# Altium schematic sheet PWR_PROT.SchDoc
size C; SheetNumber: 3; SheetTotal: 9
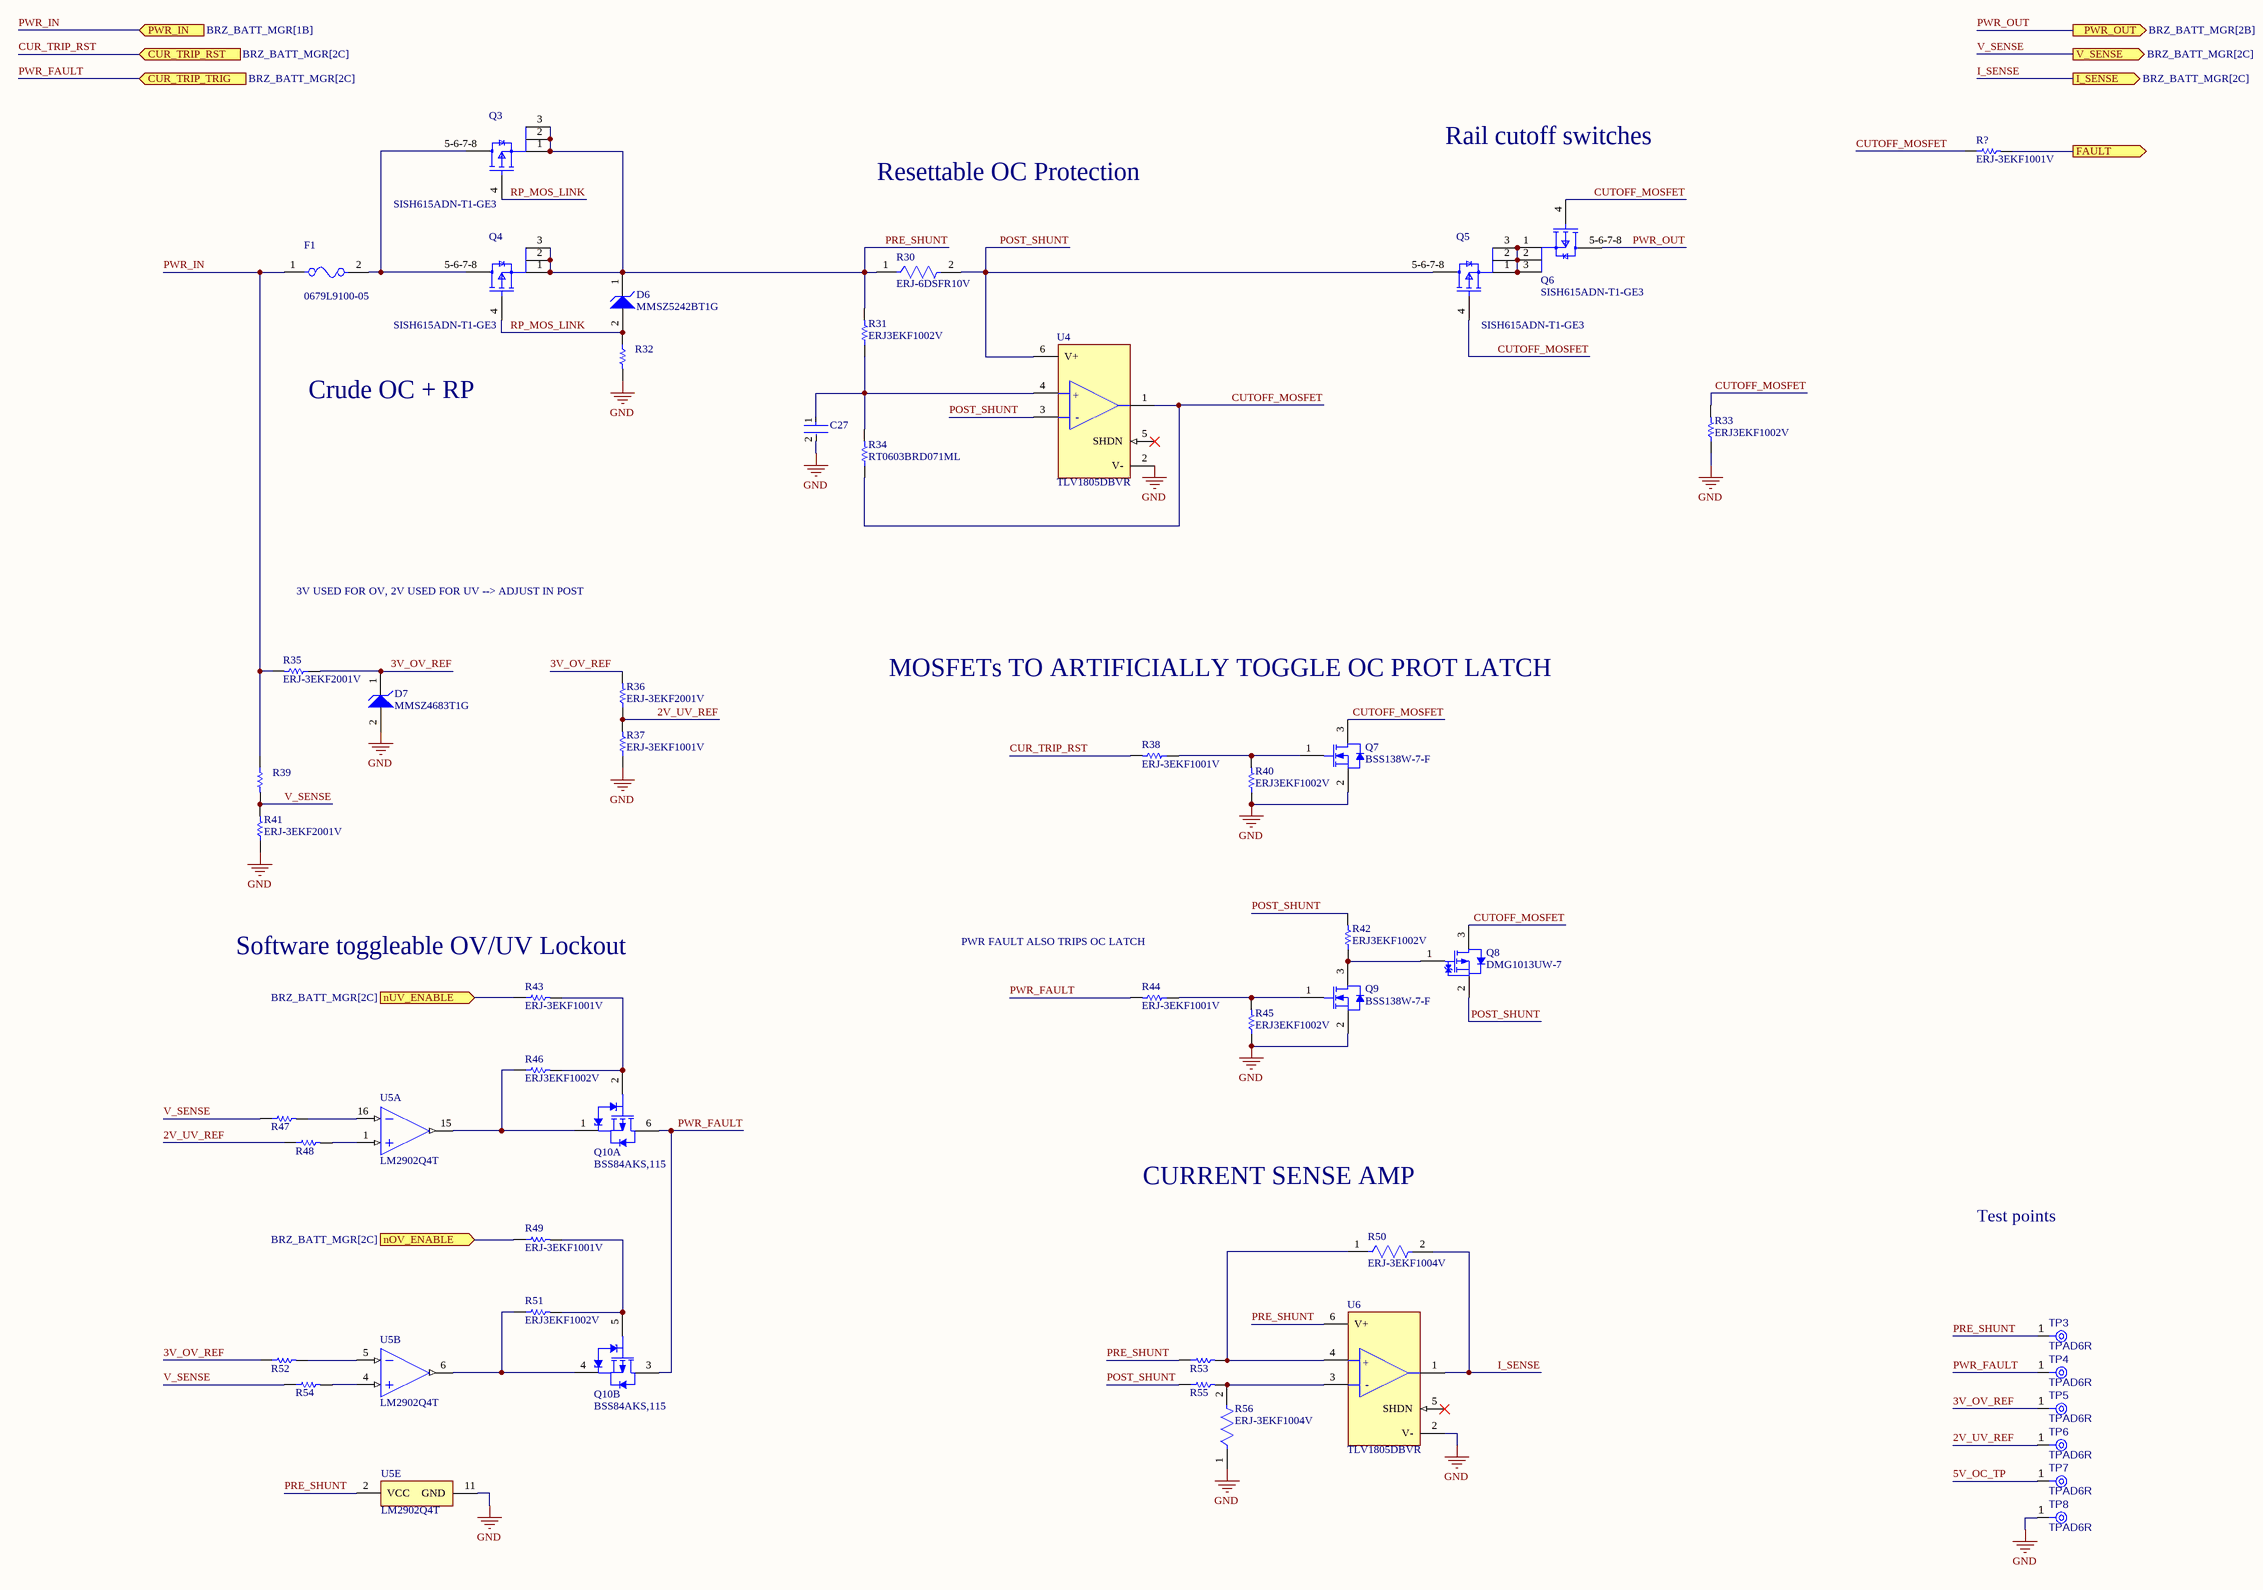
[diagram p0: PWR_PROT.SchDoc]

## Parts
C27  GRM188R71H104KA93D  [FP-0402-L_1_0_0_05-W_0_5-IPC_A]  (value not drawn)
D6  MMSZ5242BT1G  [ONSC-SOD-123-2-425-04_V]
D7  MMSZ4683T1G  [ONSC-SOD-123-2-425-04_V]
F1  0679L9100-05  [FP-0679L-MFG]
Q3  SISH615ADN-T1-GE3  [SISH615ADN-T1-GE3-Footprint-1]
Q4  SISH615ADN-T1-GE3  [SISH615ADN-T1-GE3-Footprint-1]
Q5  SISH615ADN-T1-GE3  [SISH615ADN-T1-GE3-Footprint-1]
Q6  SISH615ADN-T1-GE3  [SISH615ADN-T1-GE3-Footprint-1]
Q7  BSS138W-7-F  [DIOD-SOT323-3_V]
Q8  DMG1013UW-7  [DIOD-SOT323-3_V]
Q9  BSS138W-7-F  [DIOD-SOT323-3_V]
Q10  BSS84AKS,115  [NXP-SOT363_L]  (parts A,B of 2)
R30  ERJ-6DSFR10V  [FP-ERJ6D-MFG]
R31  ERJ3EKF1002V  [RESC1609X55X30LL15T15]
R32  ERJ3EKF1002V  [RESC1609X55X30LL15T15]  (value not drawn)
R33  ERJ3EKF1002V  [RESC1609X55X30LL15T15]
R34  RT0603BRD071ML  [RESC1608X55X30NL20T20]
R35  ERJ-3EKF2001V  [RESC1608X55X30ML15T15]
R36  ERJ-3EKF2001V  [RESC1608X55X30ML15T15]
R37  ERJ-3EKF1001V  [RESC1608X55X30LL15T15]
R38  ERJ-3EKF1001V  [RESC1608X55X30LL15T15]
R39  ERJ3EKF1002V  [RESC1609X55X30LL15T15]  (value not drawn)
R40  ERJ3EKF1002V  [RESC1609X55X30LL15T15]
R41  ERJ-3EKF2001V  [RESC1608X55X30ML15T15]
R42  ERJ3EKF1002V  [RESC1609X55X30LL15T15]
R43  ERJ-3EKF1001V  [RESC1608X55X30LL15T15]
R44  ERJ-3EKF1001V  [RESC1608X55X30LL15T15]
R45  ERJ3EKF1002V  [RESC1609X55X30LL15T15]
R46  ERJ3EKF1002V  [RESC1609X55X30LL15T15]
R47  ERJ3EKF1002V  [RESC1609X55X30LL15T15]  (value not drawn)
R48  ERJ3EKF1002V  [RESC1609X55X30LL15T15]  (value not drawn)
R49  ERJ-3EKF1001V  [RESC1608X55X30LL15T15]
R50  ERJ-3EKF1004V  [FP-ERJ3EK-IPC_C]
R51  ERJ3EKF1002V  [RESC1609X55X30LL15T15]
R52  ERJ3EKF1002V  [RESC1609X55X30LL15T15]  (value not drawn)
R53  ERJ3EKF1002V  [RESC1609X55X30LL15T15]  (value not drawn)
R54  ERJ3EKF1002V  [RESC1609X55X30LL15T15]  (value not drawn)
R55  ERJ3EKF1002V  [RESC1609X55X30LL15T15]  (value not drawn)
R56  ERJ-3EKF1004V  [FP-ERJ3EK-IPC_C]
R?  ERJ-3EKF1001V  [RESC1608X55X30LL15T15]
TP3  TPAD6R  [TP06R]  (no BOM)
TP4  TPAD6R  [TP06R]  (no BOM)
TP5  TPAD6R  [TP06R]  (no BOM)
TP6  TPAD6R  [TP06R]  (no BOM)
TP7  TPAD6R  [TP06R]  (no BOM)
TP8  TPAD6R  [TP06R]  (no BOM)
U4  TLV1805DBVR  [FP-DBV0006A-IPC_C]
U5  LM2902Q4T  [LM2902Q4T-Footprint-1]  (parts A,B,E of 5)
U6  TLV1805DBVR  [FP-DBV0006A-IPC_C]

## Ports
CUR_TRIP_RST (in, see BRZ_BATT_MGR[2C]), CUR_TRIP_TRIG (in, see BRZ_BATT_MGR[2C]), FAULT (out), I_SENSE (out, see BRZ_BATT_MGR[2C]), nOV_ENABLE (in, see BRZ_BATT_MGR[2C]), nUV_ENABLE (in, see BRZ_BATT_MGR[2C]), PWR_IN (in, see BRZ_BATT_MGR[1B]), PWR_OUT (out, see BRZ_BATT_MGR[2B]), V_SENSE (out, see BRZ_BATT_MGR[2C])

## Nets
GND: C27.2 D7.2(A) Q7.2(S) Q9.2(S) R32.2 R33.1 R37.1 R40.1 R41.1 R45.1 R56.1 TP8.1(TP) U4.2(V-) U5.11(GND) U6.2(V-)
2V_UV_REF: R36.1 R37.2 R48.1 TP6.1(TP)
3V_OV_REF: D7.1(K) R35.1 R36.2 R52.1 TP5.1(TP)
5V_OC_TP: TP7.1(TP)
CUR_TRIP_RST: R38.2 ; port CUR_TRIP_RST
CUTOFF_MOSFET: Q5.4(G) Q6.4(G) Q7.3(D) Q8.3(D) R33.2 R34.1 R?.1 U4.1(OUT)
FAULT: R?.2 ; port FAULT
I_SENSE: R50.2 U6.1(OUT) ; port I_SENSE
nOV_ENABLE: R49.1 ; port nOV_ENABLE
nUV_ENABLE: R43.1 ; port nUV_ENABLE
POST_SHUNT: Q5.5-6-7-8(D) Q8.2(S) R30.2 R42.2 R55.1 U4.3(-IN) U4.6(V+)
PRE_SHUNT: D6.1(K) Q3.1(S) Q3.2(S) Q3.3(S) Q4.1(S) Q4.2(S) Q4.3(S) R30.1 R31.2 R53.1 TP3.1(TP) U5.2(VCC) U6.6(V+)
PWR_FAULT: Q10.3(D2) Q10.6(D1) R44.2 TP4.1(TP) ; port CUR_TRIP_TRIG
PWR_IN: F1.1 R35.2 R39.1 ; port PWR_IN
PWR_OUT: Q6.5-6-7-8(D) ; port PWR_OUT
RP_MOS_LINK: D6.2(A) Q3.4(G) Q4.4(G) R32.1
V_SENSE: R39.2 R41.2 R47.1 R54.1 ; port V_SENSE
NetC27_1: C27.1 R31.1 R34.2 U4.4(+IN)
NetF1_2: F1.2 Q3.5-6-7-8(D) Q4.5-6-7-8(D)
NetQ5_1: Q5.1(S) Q5.2(S) Q5.3(S) Q6.1(S) Q6.2(S) Q6.3(S)
NetQ7_1: Q7.1(G) R38.1 R40.2
NetQ8_1: Q8.1(G) Q9.3(D) R42.1
NetQ9_1: Q9.1(G) R44.1 R45.2
NetQ10_1: Q10.1(S1) R46.1 U5.15(1OUT)
NetQ10_2: Q10.2(G1) R43.2 R46.2
NetQ10_4: Q10.4(S2) R51.1 U5.6(2OUT)
NetQ10_5: Q10.5(G2) R49.2 R51.2
NetR47_2: R47.2 U5.16(1IN-)
NetR48_2: R48.2 U5.1(1IN+)
NetR50_1: R50.1 R53.2 U6.4(+IN)
NetR52_2: R52.2 U5.5(2IN-)
NetR54_2: R54.2 U5.4(2IN+)
NetR55_2: R55.2 R56.2 U6.3(-IN)

Not connected (* = marked no-connect by the designer): U4 5(SHDN)*; U6 5(SHDN)*

## Notes on the sheet
- Rail cutoff switches
- Resettable OC Protection
- Crude OC + RP
- 3V USED FOR OV, 2V USED FOR UV --> ADJUST IN POST
- MOSFETs TO ARTIFICIALLY TOGGLE OC PROT LATCH
- (near R43) Software toggleable OV/UV Lockout
- PWR FAULT ALSO TRIPS OC LATCH
- CURRENT SENSE AMP
- Test points
- (in symbol CMP-04896-000098-1) +; -

## Library data of the parts
C27 = CMP-001-00058-1: LARGE PADS, 0402 CAP, CHANGE COMMENT TO MATCH REAL P/N; Capacitor Type: Ceramic; Min Operating Temperature: -55°C; Mounting Technology: Surface Mount; Pins: 2; Case/Package: 0402; RoHS Compliant: Yes; Max Operating Temperature: 85°C
D6 = CMP-1060-00565-1: Zener Voltage Regulator, 500 mW, 2-Pin SOD-123, Pb-Free, Tape and Reel; Manufacturer: On Semiconductor; P Max (W): 0.5; VZ Typ (V): 12; PartNumber: MMSZ5242BT1G; PackageReference: SOD-123-2-425-04; ComponentLink3URL: http://www.onsemi.com/pub_link/Collateral/425-04.PDF; Mounting Technology: Surface Mount; ComponentLink2Description: Datasheet; ComponentLink1URL: http://www.onsemi.com/; ComponentLink3Description: Package Specification; PackageDescription: 2-Pin SOD, Body 1.6 x 2.69 mm; PackageVersion: Rev. G, 10/2009; ComponentLink1Description: Manufacturer URL; RoHS: Pb-Free; ComponentLink2URL: http://www.onsemi.com/pub_link/Collateral/MMSZ5221BT1-D.PDF; Packing: Tape and Reel; DatasheetVersion: Rev. 12
D7 = CMP-1060-00600-1: Zener Voltage Regulator, 500 mW, 2-Pin SOD-123, Pb-Free, Tape and Reel; Manufacturer: On Semiconductor; P Max (W): 0.5; VZ Typ (V): 3; ComponentLink2Description: Datasheet; ComponentLink3URL: http://www.onsemi.com/pub_link/Collateral/425-04.PDF; PackageVersion: Rev. G, 10/2009; RoHS: Pb-Free; ComponentLink2URL: http://www.onsemi.com/pub_link/Collateral/MMSZ4678T1-D.PDF; DatasheetVersion: Rev. 9; PackageDescription: 2-Pin SOD, Body 1.6 x 2.69 mm; PartNumber: MMSZ4683T1G; ComponentLink3Description: Package Specification; ComponentLink1URL: http://www.onsemi.com/; ComponentLink1Description: Manufacturer URL; Packing: Tape and Reel; PackageReference: SOD-123-2-425-04; Mounting Technology: Surface Mount
F1 = CMP-16042-000002-1: DIFF P#!!! / FUSE BRD MNT 10A 125VAC/VDC; Manufacturer: Bel Fuse; Manufacturer Part Number: 0679L9150-01; Max Fuse Ac Voltage: 125V; Fuse Blow Speed: Fast; Fuse Current: 15A; Fuse I2T: 103.5A2Sec; Fuse Interrupt Ac Current: 50A; Automotive Grade: Grade 1; Value: 0.0038Ω; Fuse Interrupt Dc Current: 300A; Fuse Voltage Drop: 0.13V; Device Class L2: Fuses; ComponentLink2URL: https://www.belfuse.com/resources/CircuitProtection/datasheets/0679L%20Sep2016.pdf; Package: 0679L; Height: 2.79mm; Digikey Description: FUSE BRD MNT 15A 125VAC/VDC; Temperature Range High: +125°C; Device Class L3: unset; Octopart: https://octopart.com/0679l9150-01-bel+fuse-70850665; Temperature Range Low: -55°C; Max Fuse Dc Voltage: 125V; Ipc Land Pattern Name: CAPC610254X254; Category: Fuse; Lead Free: Yes; Automotive: Yes; Resistance: 0.0038Ω; RoHS: TRUE; Device Class L1: Circuit Protection; ComponentLink2Description: Datasheet; Temperature: -55°C to +125°C; Voltage Rating: 125V
Q3 Q4 = CMP-013-00036-2: Trans MOSFET P-CH 20V 22.1A 8-Pin PowerPAK 1212 EP T/R
Q5 Q6 = CMP-013-00036-1: Trans MOSFET P-CH 20V 22.1A 8-Pin PowerPAK 1212 EP T/R
Q7 Q9 = CMP-2000-05968-1: N-Channel Enhancement Mode Mosfet, 50 V, 200 mA, -55 to 150 degC, 6-Pin SOT-323, RoHS, Tape and Reel; Typical Turn-Off Delay Time: 20ns; Number of Channels: 1Channel; Type: EnhancementModeFieldEffectTransistor; Brand: DiodesIncorporated; Vds - Drain-Source Breakdown Voltage: 75V; Vgs - Gate-Source Voltage: 20V; Rds On - Drain-Source Resistance: 1.4Ohms; Transistor Type: 1N-Channel; Configuration: Single; Unit Weight: 0.000212oz; Pd - Power Dissipation: 200mW; Id - Continuous Drain Current: 200mA; Forward Transconductance - Min: 0.1S; Manufacturer URL: http://www.diodes.com/; Series: BSS138; Package Description: 3-Pin Small Outline Transistor, Body 2 x 1.25 mm, Pitch 0.65 mm; Mounting Technology: SurfaceMount; Product Category: MOSFET; RoHS: True; Maximum Operating Temperature: +150C; Height: 1mm; Length: 2.2mm; Technology: Si; Width: 1.35mm; Datasheet URL: http://www.diodes.com/_files/datasheets/ds30206.pdf; Manufacturer: DiodesIncorporated; Package / Case: SOT-323-3; Typical Turn-On Delay Time: 20ns; Transistor Polarity: N-Channel; Factory Pack Quantity: 3000; Packaging: Reel; Product: MOSFETSmallSignal; Datasheet Version: Rev. 11-2, 09/2013; Package Reference: SOT323; Minimum Operating Temperature: -55C; Mounting Style: SMD/SMT; Channel Mode: Enhancement
Q8 = CMP-2000-06170-1: P-Channel Enhancement Mode MOSFET, 310 mW, 20 V, -55 to 150 degC, 3-Pin SOT-323, RoHS, Tape and Reel; Manufacturer: Diodes Inc; Qg Gate Charge: 0.622nC; Drain-Source On Resistance-Max: 750mO; Rated Power Dissipation: 310mW; Drain-to-Source Voltage [Vdss]: 20V; Package Reference: SOT323; Datasheet Version: Rev. 3-2, 09/2013; Package Description: 3-Pin Small Outline Transistor, Body 2 x 1.25 mm, Pitch 0.65 mm; Mounting Technology: SurfaceMount; Manufacturer URL: http://www.diodes.com/; Datasheet URL: http://www.diodes.com/_files/datasheets/ds31861.pdf; Channel Type: P-Channel
Q10 = CMP-1259-00116-1: Dual P-Channel Trench MOSFET, -50 V, -0.16 A, -55 to 150 degC, 6-Pin SOT363, Tape and Reel; Manufacturer: NXP Semiconductors; VGSth [typ] (V): -1.6; Automotive Qualified: Y; Channel Type: P; IDM [max] (A): -0.64; Packing: Tape & Reel; Mounting Technology: Surface Mount; PackageDescription: 6-Pin Small Outline Transistor Package, Body 2 x 1.25 mm, Pitch 0.65 mm; ComponentLink2URL: http://www.nxp.com/documents/data_sheet/BSS84AKS.pdf; ComponentLink3URL: http://www.nxp.com/documents/outline_drawing/sot363_po.pdf; PartNumber: BSS84AKS,115; PackageReference: SOT363; PackageVersion: 06-03-16, 03/2006; ComponentLink3Description: Package Specification; ComponentLink2Description: Datasheet; ComponentLink1Description: Manufacturer URL; VDS [max] (V): -50; Code_JEITA: SC-88; ID [max] (A): -0.16; DatasheetVersion: Rev. 1; ComponentLink1URL: http://www.nxp.com/
R30 = CMP-05422-000098-1: RES 0.1 OHM 1% 1/2W 0805; Temperature Coefficient: 150ppm/°C; Resistance: 100mR; Max Power Dissipation: 500mW; Tolerance: 1%; Length: 0.079inch; Features: Automotive AEC-Q200; Width: 0.049inch; Resistor Type: Thick Film; Case Code (Metric): 2012; Number of Terminations: 2; Max Operating Temperature: 155°C; Case/Package: 0805; Height: 0.028inch; Packaging: Cut Tape; Case Code (Imperial): 0805; Min Operating Temperature: -55°C
R31-R33 R39 R40 R42 R45-R48 R51-R55 = CMP-1012-00623-3: Chip Resistor, 10 KOhm, +/- 1%, 0.1 W, -55 to 155 degC, 0603 (1608 Metric), RoHS, Tape and Reel; Manufacturer: Panasonic; Voltage Rating: 75V; Case\/Package: 0603; Power Rating: 100mW; Resistance: 10KOhm; Temperature Coefficient: 100ppm\/degreesC; Number of Pins: 2; Package Reference: 603; Depth: 0.8mm; Mount: SurfaceMount; Package Description: 2-Pin Surface Mount Device, Body 1.6 x 0.85 mm; Datasheet Version: 02/2017; Length: 1.6mm; Lead Free: LeadFree; Height: 0.45mm; Number of Terminations: 2; Max Power Dissipation: 100mW; Min Operating Temperature: -55degC; Datasheet URL: https://industrial.panasonic.com/cdbs/www-data/pdf/RDA0000/AOA0000C304.pdf; Termination: SMD/SMT; Case Code (Metric): 1608; Case Code (Imperial): 0603; Tolerance: 1%; Max Operating Temperature: 155degC; RoHSCompliant: true; Voltage Rating (DC): 75V; Radiation Hardening: No; Packaging: TapeandReel; Composition: ThickFilm; Mounting Technology: SurfaceMount; Manufacturer URL: http://www.panasonic.com/; Width: 0.031inch; REACH SVHC: NoSVHC; Contact Plating: Tin; Military Standard: Not; Package Quantity: 1
R34 = CMP-2000-00925-1: NOT PANASONIC, THIS IS A 1M RESISTORhttps://www.yageo.com/upload/media/product/productsearch/datasheet/rchip/PYu-RT_1-to-0.01_RoHS_L_13.pdf; Part Number: ERA-3AEB163V; Manufacturer: Panasonic
R35 R36 R41 = CMP-2000-00317-1: Manufacturer: Panasonic; Part Number: ERJ-3EKF2001V
R37 R38 R43 R44 R49 R? = CMP-2000-00180-1: Manufacturer: Panasonic; Part Number: ERJ-3EKF1001V
R50 R56 = CMP-1012-00849-3: RES SMD 1M OHM 1% 1/10W 0603; Resistance: 1MR; Voltage Rating: 75V; Temperature Coefficient: 100ppm/°C; Power Rating: 100mW; REACH SVHC: No SVHC; Radiation Hardening: No; Features: Automotive AEC-Q200; Case Code (Metric): 1608; Resistance Tolerance: 1%; Case/Package: 0603; Termination: SMD/SMT; Max Operating Temperature: 155°C; Tolerance: 1%; Size Code: 0603; Case Code (Imperial): 0603; Min Operating Temperature: -55°C; Number of Pins: 2; Mount: Surface Mount; Package Quantity: 1; Military Standard: Not; Voltage Rating (DC): 75V; Depth: 0.8mm; Packaging: Tape and Reel; Width: 0.8mm; Number of Terminations: 2; Length: 1.6mm; Height: 0.022inch; RoHS Compliant: Yes; Resistor Type: Thick Film; Contact Plating: Tin; Lead Free: Lead Free; Series: ERJ; Construction: Rectangular; Max Power Dissipation: 100mW
TP3-TP8 = CMP-00028-00002-2: 0.6mm round; Pins: 1
U4 U6 = CMP-04896-000098-1: 40V, RAIL-TO-RAIL INPUT, PUSH-PU
U5 = CMP-014-00004-1: LM2902 Series 30 V 1.3 MHz Low-Power Quad Operational Amplifier - QFN-16 (3x3)